# Altium project iMX6_Pixhawk.PrjPcb (part 2 of 6)

## Sheet [05] - HDMI INPUT.SchDoc
size A3; DocumentNumber: 5; SheetNumber: 5; SheetTotal: 18
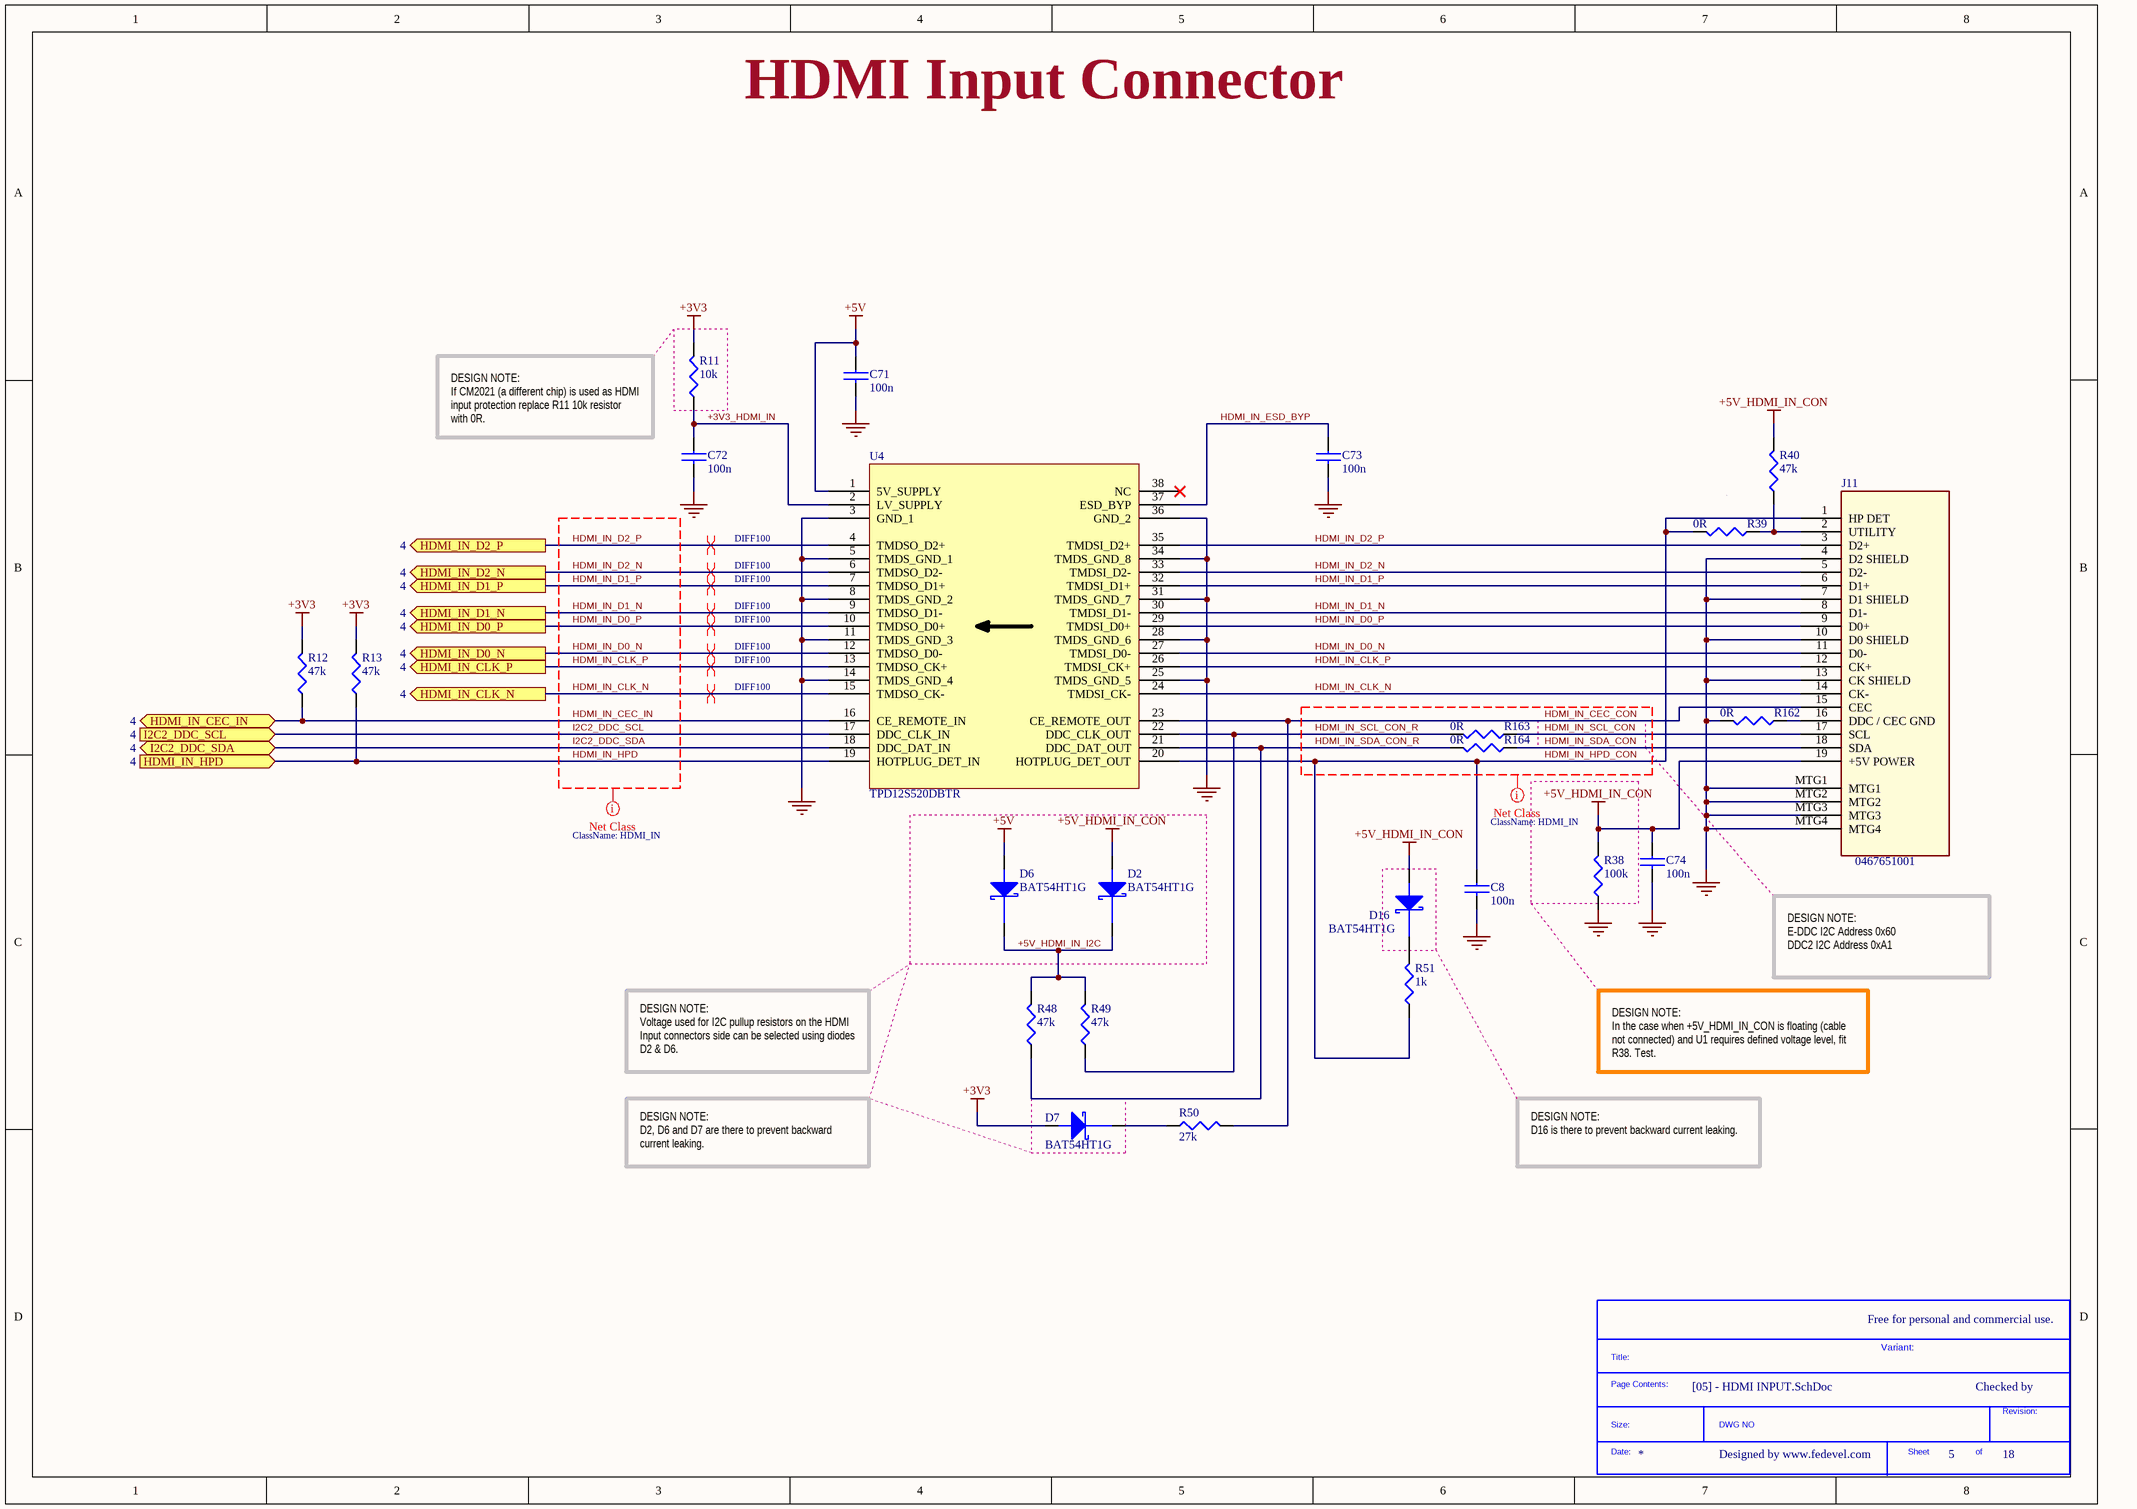
[diagram p7: [05] - HDMI INPUT.SchDoc]

### Parts
(Parts that share a designator on the sheet are numbered #1, #2 ... from top to bottom, then left to right.)
*#5  SDTitleBlock  (value not drawn)  (graphical)
C8  100n  [C0402]
C71  100n  [C0402]
C72  100n  [C0402]
C73  100n  [C0402]
C74  100n  [C0402]
D2  BAT54HT1G  [SOD323]
D6  BAT54HT1G  [SOD323]
D7  BAT54HT1G  [SOD323]
D16  BAT54HT1G  [SOD323]
J11  0467651001  [Micro_HDMI]
R11  10k  [R0402]
R12  47k  [R0402]
R13  47k  [R0402]
R38  100k  [R0402]
R39  0R  [R0402]
R40  47k  [R0402]
R48  47k  [R0402]
R49  47k  [R0402]
R50  27k  [R0402]
R51  1k  [R0402]
R162  0R  [R0402]
R163  0R  [R0402]
R164  0R  [R0402]
U4  TPD12S520DBTR  [TSSOP_38]

### Ports
HDMI_IN_CEC_IN (bidir, see 4), HDMI_IN_CLK_N (out, see 4), HDMI_IN_CLK_P (out, see 4), HDMI_IN_D0_N (out, see 4), HDMI_IN_D0_P (out, see 4), HDMI_IN_D1_N (out, see 4), HDMI_IN_D1_P (out, see 4), HDMI_IN_D2_N (out, see 4), HDMI_IN_D2_P (out, see 4), HDMI_IN_HPD (in, see 4), I2C2_DDC_SCL (in, see 4), I2C2_DDC_SDA (bidir, see 4)

### Nets
+3V3: D7.2(Anode) R11.2 R12.2 R13.2
+5V: C71.1 D6.2(Anode) U4.1(5V_SUPPLY)
+5V_HDMI_IN_CON: C74.1 D2.2(Anode) D16.2(Anode) J11.19(+5V_POWER) R38.2 R40.2
GND: C8.2 C71.2 C72.2 C73.2 C74.2 J11.4(D2_SHIELD) J11.7(D1_SHIELD) J11.10(D0_SHIELD) J11.13(CK_SHIELD) J11.MTG1 J11.MTG2 J11.MTG3 J11.MTG4 R38.1 R162.2 U4.3(GND_1) U4.5(TMDS_GND_1) U4.8(TMDS_GND_2) U4.11(TMDS_GND_3) U4.14(TMDS_GND_4) U4.25(TMDS_GND_5) U4.28(TMDS_GND_6) U4.31(TMDS_GND_7) U4.34(TMDS_GND_8) U4.36(GND_2)
+3V3_HDMI_IN: C72.1 R11.1 U4.2(LV_SUPPLY)
+5V_HDMI_IN_I2C: D2.1(Cathode) D6.1(Cathode) R48.2 R49.2
HDMI_IN_CEC_CON: J11.15(CEC) R50.2 U4.23(CE_REMOTE_OUT)
HDMI_IN_CEC_IN: R12.1 U4.16(CE_REMOTE_IN) ; port HDMI_IN_CEC_IN
HDMI_IN_CLK_N: J11.14(CK-) U4.15(TMDSO_CK-) U4.24(TMDSI_CK-) ; port HDMI_IN_CLK_N
HDMI_IN_CLK_P: J11.12(CK+) U4.13(TMDSO_CK+) U4.26(TMDSI_CK+) ; port HDMI_IN_CLK_P
HDMI_IN_D0_N: J11.11(D0-) U4.12(TMDSO_D0-) U4.27(TMDSI_D0-) ; port HDMI_IN_D0_N
HDMI_IN_D0_P: J11.9(D0+) U4.10(TMDSO_D0+) U4.29(TMDSI_D0+) ; port HDMI_IN_D0_P
HDMI_IN_D1_N: J11.8(D1-) U4.9(TMDSO_D1-) U4.30(TMDSI_D1-) ; port HDMI_IN_D1_N
HDMI_IN_D1_P: J11.6(D1+) U4.7(TMDSO_D1+) U4.32(TMDSI_D1+) ; port HDMI_IN_D1_P
HDMI_IN_D2_N: J11.5(D2-) U4.6(TMDSO_D2-) U4.33(TMDSI_D2-) ; port HDMI_IN_D2_N
HDMI_IN_D2_P: J11.3(D2+) U4.4(TMDSO_D2+) U4.35(TMDSI_D2+) ; port HDMI_IN_D2_P
HDMI_IN_ESD_BYP: C73.1 U4.37(ESD_BYP)
HDMI_IN_HPD: R13.1 U4.19(HOTPLUG_DET_IN) ; port HDMI_IN_HPD
HDMI_IN_HPD_CON: C8.1 J11.1(HP_DET) R39.2 R51.1 U4.20(HOTPLUG_DET_OUT)
HDMI_IN_SCL_CON: J11.17(SCL) R163.1
HDMI_IN_SCL_CON_R: R49.1 R163.2 U4.22(DDC_CLK_OUT)
HDMI_IN_SDA_CON: J11.18(SDA) R164.1
HDMI_IN_SDA_CON_R: R48.1 R164.2 U4.21(DDC_DAT_OUT)
I2C2_DDC_SCL: U4.17(DDC_CLK_IN) ; port I2C2_DDC_SCL
I2C2_DDC_SDA: U4.18(DDC_DAT_IN) ; port I2C2_DDC_SDA
NetD7_1: D7.1(Cathode) R50.1
NetD16_1: D16.1(Cathode) R51.2
NetJ11_2: J11.2(UTILITY) R39.1 R40.1
NetJ11_16: J11.16(DDC_/_CEC_GND) R162.1

Not connected (* = marked no-connect by the designer): U4 38(NC)*

### Layout directives
net class HDMI_IN: HDMI_IN_CEC_CON, HDMI_IN_CEC_IN, HDMI_IN_CLK_N, HDMI_IN_CLK_P, HDMI_IN_D0_N, HDMI_IN_D0_P, HDMI_IN_D1_N, HDMI_IN_D1_P, HDMI_IN_D2_N, HDMI_IN_D2_P, HDMI_IN_HPD, HDMI_IN_HPD_CON, HDMI_IN_SCL_CON, HDMI_IN_SCL_CON_R, HDMI_IN_SDA_CON, HDMI_IN_SDA_CON_R, I2C2_DDC_SCL, I2C2_DDC_SDA
differential pair; net class DIFF100: HDMI_IN_CLK_N, HDMI_IN_CLK_P, HDMI_IN_D0_N, HDMI_IN_D0_P, HDMI_IN_D1_N, HDMI_IN_D1_P, HDMI_IN_D2_N, HDMI_IN_D2_P

### Notes on the sheet
- HDMI Input Connector
- DESIGN NOTE:
  If CM2021 (a different chip) is used as HDMI input protection replace R11 10k resistor with 0R.
- DESIGN NOTE:
  E-DDC I2C Address 0x60
  DDC2 I2C Address 0xA1
- DESIGN NOTE:
  In the case when +5V_HDMI_IN_CON is floating (cable not connected) and U1 requires defined voltage level, fit R38. Test.
- DESIGN NOTE:
  Voltage used for I2C pullup resistors on the HDMI Input connectors side can be selected using diodes D2 & D6.
- DESIGN NOTE:
  D2, D6 and D7 are there to prevent backward current leaking.
- DESIGN NOTE:
  D16 is there to prevent backward current leaking.
- Free for personal and commercial use.
- Variant:
- Checked by
- Designed by www.fedevel.com
- (in symbol SDTitleBlock) Title:; Page Contents:; Revision:; Size:; DWG NO; Date:; Sheet; of

### Library data of the parts
C8 C71-C74 = C1005X5R1H104K: as C4 on sheet [03] - CONNECTORS; Category: Capacitors; Supplier Part Number: 445-5942-1-ND; Manufacturer Part Number: C1005X5R1H104K; Operating Temperature: -55°C ~ 85°C; Package / Case: 0402 (1005 Metric); Price 1k [$]: 0.02340; .Checked SCH: used; Voltage - Rated: 50V; Supplier: Digikey; Supplier 1: Digi-Key; Supplier Part Number 1: 445-5942-1-ND; RoHS: RoHS Compliant; Stock 1: 106926; Pricing 1: 1=0.27, 10=0.18, 100=0.072, 250=0.05176, 500=0.0369, 1000=0.027 (USD); Tolerance: ±10%; Temperature Coefficient: X5R; Mounting Type: Surface Mount, MLCC; Applications: General Purpose; Ratings: -; Size / Dimension: 0.039" L x 0.020" W (1.00mm x 0.50mm); Height - Seated (Max): -; Thickness (Max): 0.022" (0.55mm); Lead Spacing: -; Features: -; Packaging: Cut Tape (CT); Lead Style: -; ComponentLink1URL: http://www.tdk.co.jp/tefe02/e412_c.pdf; ComponentLink1Description: http://www.tdk.co.jp/tefe02/e412_c.pdf
D2 D6 D7 D16 = BAT54HT1G: DIODE SCHOTTKY 30V 0.2A SOD323; Manufacturer: Fairchild Semiconductor; Current - Average Rectified (Io): 200mA; Voltage - Forward (Vf) (Max) @ If: 800mV @ 100mA; Speed: Small Signal =< 200mA (Io), Any Speed; Reverse Recovery Time (trr): 5ns; Current - Reverse Leakage @ Vr: 2µA @ 25V; Capacitance @ Vr, F: 10pF @ 1V, 1MHz; Thermal Resistance: 600°C/W Ja; .Creator: MM; .Checked PCB: used; Supplier 1: Digi-Key; Manufacturer Part Number: BAT54HT1G; RoHS: RoHS Compliant; Category: Discrete Semiconductor Products; Stock 1: 11388; Pricing 1: 1=0.3, 10=0.276, 25=0.1984, 100=0.1543, 250=0.09696, 500=0.0826, 1000=0.05628 (USD); Packaging: Cut Tape (CT); Diode Type: Schottky; Voltage - DC Reverse (Vr) (Max): 30V; Mounting Type: Surface Mount; Package / Case: SC-76, SOD-323; Supplier Device Package: SOD-323; Operating Temperature - Junction: -55°C ~ 150°C; ComponentLink1URL: http://www.fairchildsemi.com/ds/BA/BAT54HT1G.pdf; ComponentLink1Description: http://www.fairchildsemi.com/ds/BA/BAT54HT1G.pdf; Supplier Part Number 1: BAT54HT1GCT-ND; .Checked SCH: used
J11 = 0467651001: CONN RCPT HDMI MICRO TYPE-D R/A; Manufacturer: Molex Inc; Connector Type: HDMI - Micro; Number of Contacts: 19; Gender: Receptacle; .Creator: MM; .Checked PCB: MM, paper model not checked; Supplier 1: Digi-Key; Manufacturer Part Number: 0467651001; RoHS: RoHS Compliant; Category: Connectors, Interconnects; Stock 1: 11830; Pricing 1: 1=2.66, 10=2.414, 25=2.2664, 50=2.1678, 100=2.0693, 250=1.87224, 500=1.72442 (USD); Packaging: Cut Tape (CT); Specifications: -; Mounting Type: Surface Mount, Right Angle, Horizontal; Features: Board Guide; Ingress Protection: -; ComponentLink1URL: http://www.molex.com/pdm_docs/sd/467651001_sd.pdf; ComponentLink1Description: http://www.molex.com/pdm_docs/sd/467651001_sd.pdf; Supplier Part Number 1: WM1282CT-ND; .Checked SCH: MM
R11 = RC0402FR-0710KL: as R1 on sheet [04] - VIDEO INPUT; Category: Resistors; Supplier Part Number: 311-10.0KLRCT-ND; Manufacturer Part Number: RC0402FR-0710KL; Package / Case: 0402 (1005 Metric); Price 1k [$]: 0.01421; Resistance (Ohms): 10K; Tolerance: ±1%; Value: 10k; .Checked SCH: used; Supplier: Digikey; Supplier 1: Digi-Key; Supplier Part Number 1: 311-10.0KLRCT-ND; RoHS: RoHS Compliant; Stock 1: 2916495; Pricing 1: 10=0.014, 50=0.0104, 100=0.0079, 250=0.00584, 500=0.00432, 1000=0.00288 (USD); Composition: Thick Film; Features: -; Size / Dimension: 0.039" L x 0.020" W (1.00mm x 0.50mm); Height: 0.016" (0.40mm); Number of Terminations: 2; Packaging: Cut Tape (CT); ComponentLink1URL: http://www.yageo.com/documents/recent/PYu-RC0402_51_RoHS_L_6.pdf; ComponentLink1Description: http://www.yageo.com/documents/recent/PYu-RC0402_51_RoHS_L_6.pdf
R12 R13 R40 R48 R49 = RC0402FR-0747KL: RES 47.0K OHM 1/16W 1% 0402 SMD; Manufacturer: Yageo; Power (Watts): 0.063W, 1/16W; .Checked PCB: used; Temperature Coefficient: ±100ppm/°C; Category: Resistors; Supplier Part Number: 311-47.0KLRCT-ND; Manufacturer Part Number: RC0402FR-0747KL; Package / Case: 0402 (1005 Metric); Price 1k [$]: 0.01421; Resistance (Ohms): 47K; Tolerance: ±1%; Value: 47k; .Checked SCH: used; Supplier: Digikey; Supplier 1: Digi-Key; Supplier Part Number 1: 311-47.0KLRCT-ND; RoHS: RoHS Compliant; Stock 1: 1227580; Pricing 1: 10=0.014, 50=0.0104, 100=0.0079, 250=0.00584, 500=0.00432, 1000=0.00288 (USD); Composition: Thick Film; Features: -; Size / Dimension: 0.039" L x 0.020" W (1.00mm x 0.50mm); Height: 0.016" (0.40mm); Number of Terminations: 2; Packaging: Cut Tape (CT); ComponentLink1URL: http://www.yageo.com/documents/recent/PYu-RC0402_51_RoHS_L_6.pdf; ComponentLink1Description: http://www.yageo.com/documents/recent/PYu-RC0402_51_RoHS_L_6.pdf
R38 = RMCF0402FT100K: RES 100K OHM 1/16W 1% 0402 SMD; Manufacturer: Stackpole Electronics Inc; Power (Watts): 0.063W, 1/16W; .Checked PCB: used; Temperature Coefficient: ±100ppm/°C; Category: Resistors; Supplier Part Number: RMCF0402FT100KCT-ND; Manufacturer Part Number: RMCF0402FT100K; Package / Case: 0402 (1005 Metric); Price 1k [$]: 0.00384; Resistance (Ohms): 100K; Tolerance: ±1%; Value: 100k; .Checked SCH: used; Supplier: Digikey; Supplier 1: Digi-Key; Supplier Part Number 1: RMCF0402FT100KCT-ND; RoHS: RoHS Compliant; Stock 1: 95; Pricing 1: 1=0.04, 10=0.025, 50=0.0138, 100=0.0105, 250=0.0078, 500=0.00576, 1000=0.00384 (USD); Composition: Thick Film; Features: -; Size / Dimension: 0.039" L x 0.020" W (1.00mm x 0.50mm); Height: 0.016" (0.40mm); Number of Terminations: 2; Packaging: Cut Tape (CT); ComponentLink1URL: http://www.seielect.com/Catalog/SEI-RMCF.pdf; ComponentLink1Description: http://www.seielect.com/Catalog/SEI-RMCF.pdf
R39 R162-R164 = RC0402JR-070RL: as R5 on sheet [04] - VIDEO INPUT; Category: Resistors; Manufacturer Part Number: RC0402JR-070RL; Package / Case: 0402 (1005 Metric); Price 1k [$]: 0.01389; Value: 0R; .Checked SCH: used; Supplier Part Number: 311-0.0JRCT-ND; Supplier: Digikey; Supplier 1: Digi-Key; Supplier Part Number 1: 311-0.0JRCT-ND; RoHS: RoHS Compliant; Stock 1: 1106330; Pricing 1: 10=0.012, 50=0.009, 100=0.0069, 250=0.00512, 500=0.0038, 1000=0.00253 (USD); Composition: Thick Film; Features: -; Temperature Coefficient: -; Size / Dimension: 0.039" L x 0.020" W (1.00mm x 0.50mm); Height: 0.016" (0.40mm); Number of Terminations: 2; Packaging: Cut Tape (CT); ComponentLink1URL: http://www.yageo.com/documents/recent/PYu-RC0402_51_RoHS_L_6.pdf; ComponentLink1Description: http://www.yageo.com/documents/recent/PYu-RC0402_51_RoHS_L_6.pdf
R50 = RC0402FR-0727KL: RES 27.0K OHM 1/16W 1% 0402 SMD; Manufacturer: Yageo; Power (Watts): 0.063W, 1/16W; .Checked PCB: used; Temperature Coefficient: ±100ppm/°C; Category: Resistors; Supplier Part Number: 311-27.0KLRCT-ND; Manufacturer Part Number: RC0402FR-0727KL; Package / Case: 0402 (1005 Metric); Price 1k [$]: 0.00288; Resistance (Ohms): 27K; Tolerance: ±1%; Value: 27k; .Checked SCH: used; Supplier: Digikey; Supplier 1: Digi-Key; Supplier Part Number 1: 311-27.0KLRCT-ND; RoHS: RoHS Compliant; Stock 1: 21638; Pricing 1: 10=0.014, 50=0.0104, 100=0.0079, 250=0.00584, 500=0.00432, 1000=0.00288 (USD); Composition: Thick Film; Features: -; Size / Dimension: 0.039" L x 0.020" W (1.00mm x 0.50mm); Height: 0.016" (0.40mm); Number of Terminations: 2; Packaging: Cut Tape (CT); ComponentLink1URL: http://www.yageo.com/documents/recent/PYu-RC0402_51_RoHS_L_6.pdf; ComponentLink1Description: http://www.yageo.com/documents/recent/PYu-RC0402_51_RoHS_L_6.pdf
R51 = RC0402FR-071KL: RES 1.00K OHM 1/16W 1% 0402 SMD; Manufacturer: Yageo; Power (Watts): 0.063W, 1/16W; .Checked PCB: used; Temperature Coefficient: ±100ppm/°C; Category: Resistors; Supplier Part Number: 311-1.00KLRCT-ND; Manufacturer Part Number: RC0402FR-071KL; Package / Case: 0402 (1005 Metric); Price 1k [$]: 0.01421; Resistance (Ohms): 1K; Tolerance: ±1%; Value: 1k; .Checked SCH: used; Supplier: Digikey; Supplier 1: Digi-Key; Supplier Part Number 1: 311-1.00KLRCT-ND; RoHS: RoHS Compliant; Stock 1: 1753477; Pricing 1: 10=0.014, 50=0.0104, 100=0.0079, 250=0.00584, 500=0.00432, 1000=0.00288 (USD); Composition: Thick Film; Features: -; Size / Dimension: 0.039" L x 0.020" W (1.00mm x 0.50mm); Height: 0.016" (0.40mm); Number of Terminations: 2; Packaging: Cut Tape (CT); ComponentLink1URL: http://www.yageo.com/documents/recent/PYu-RC0402_51_RoHS_L_6.pdf; ComponentLink1Description: http://www.yageo.com/documents/recent/PYu-RC0402_51_RoHS_L_6.pdf
U4 = TPD12S520DBTR: IC HDMI RCVR PORT PROT 38-TSSOP; Manufacturer: Texas Instruments; Voltage - Supply: 5V; .Creator: MM; Supplier 1: Digi-Key; Manufacturer Part Number: TPD12S520DBTR; RoHS: RoHS Compliant; Category: Integrated Circuits (ICs); Stock 1: 5619; Pricing 1: 1=1.87, 10=1.685, 25=1.5092, 100=1.3572, 250=1.20512, 500=1.053, 750=0.95355, 1000=0.73125 (USD); Packaging: Cut Tape (CT); Applications: Video Equipment; Interface: HDMI; Package / Case: 38-TFSOP (0.173", 4.40mm Width); Supplier Device Package: 38-TSSOP; Mounting Type: Surface Mount; ComponentLink1URL: http://www.ti.com/lit/ds/symlink/tpd12s520.pdf; ComponentLink1Description: http://www.ti.com/lit/ds/symlink/tpd12s520.pdf; Supplier Part Number 1: 296-23617-1-ND; .Checked PCB: MM; .Checked SCH: MM

## Sheet [07] - PCIE MINI.SchDoc
size A2; DocumentNumber: 7; SheetNumber: 7; SheetTotal: 18
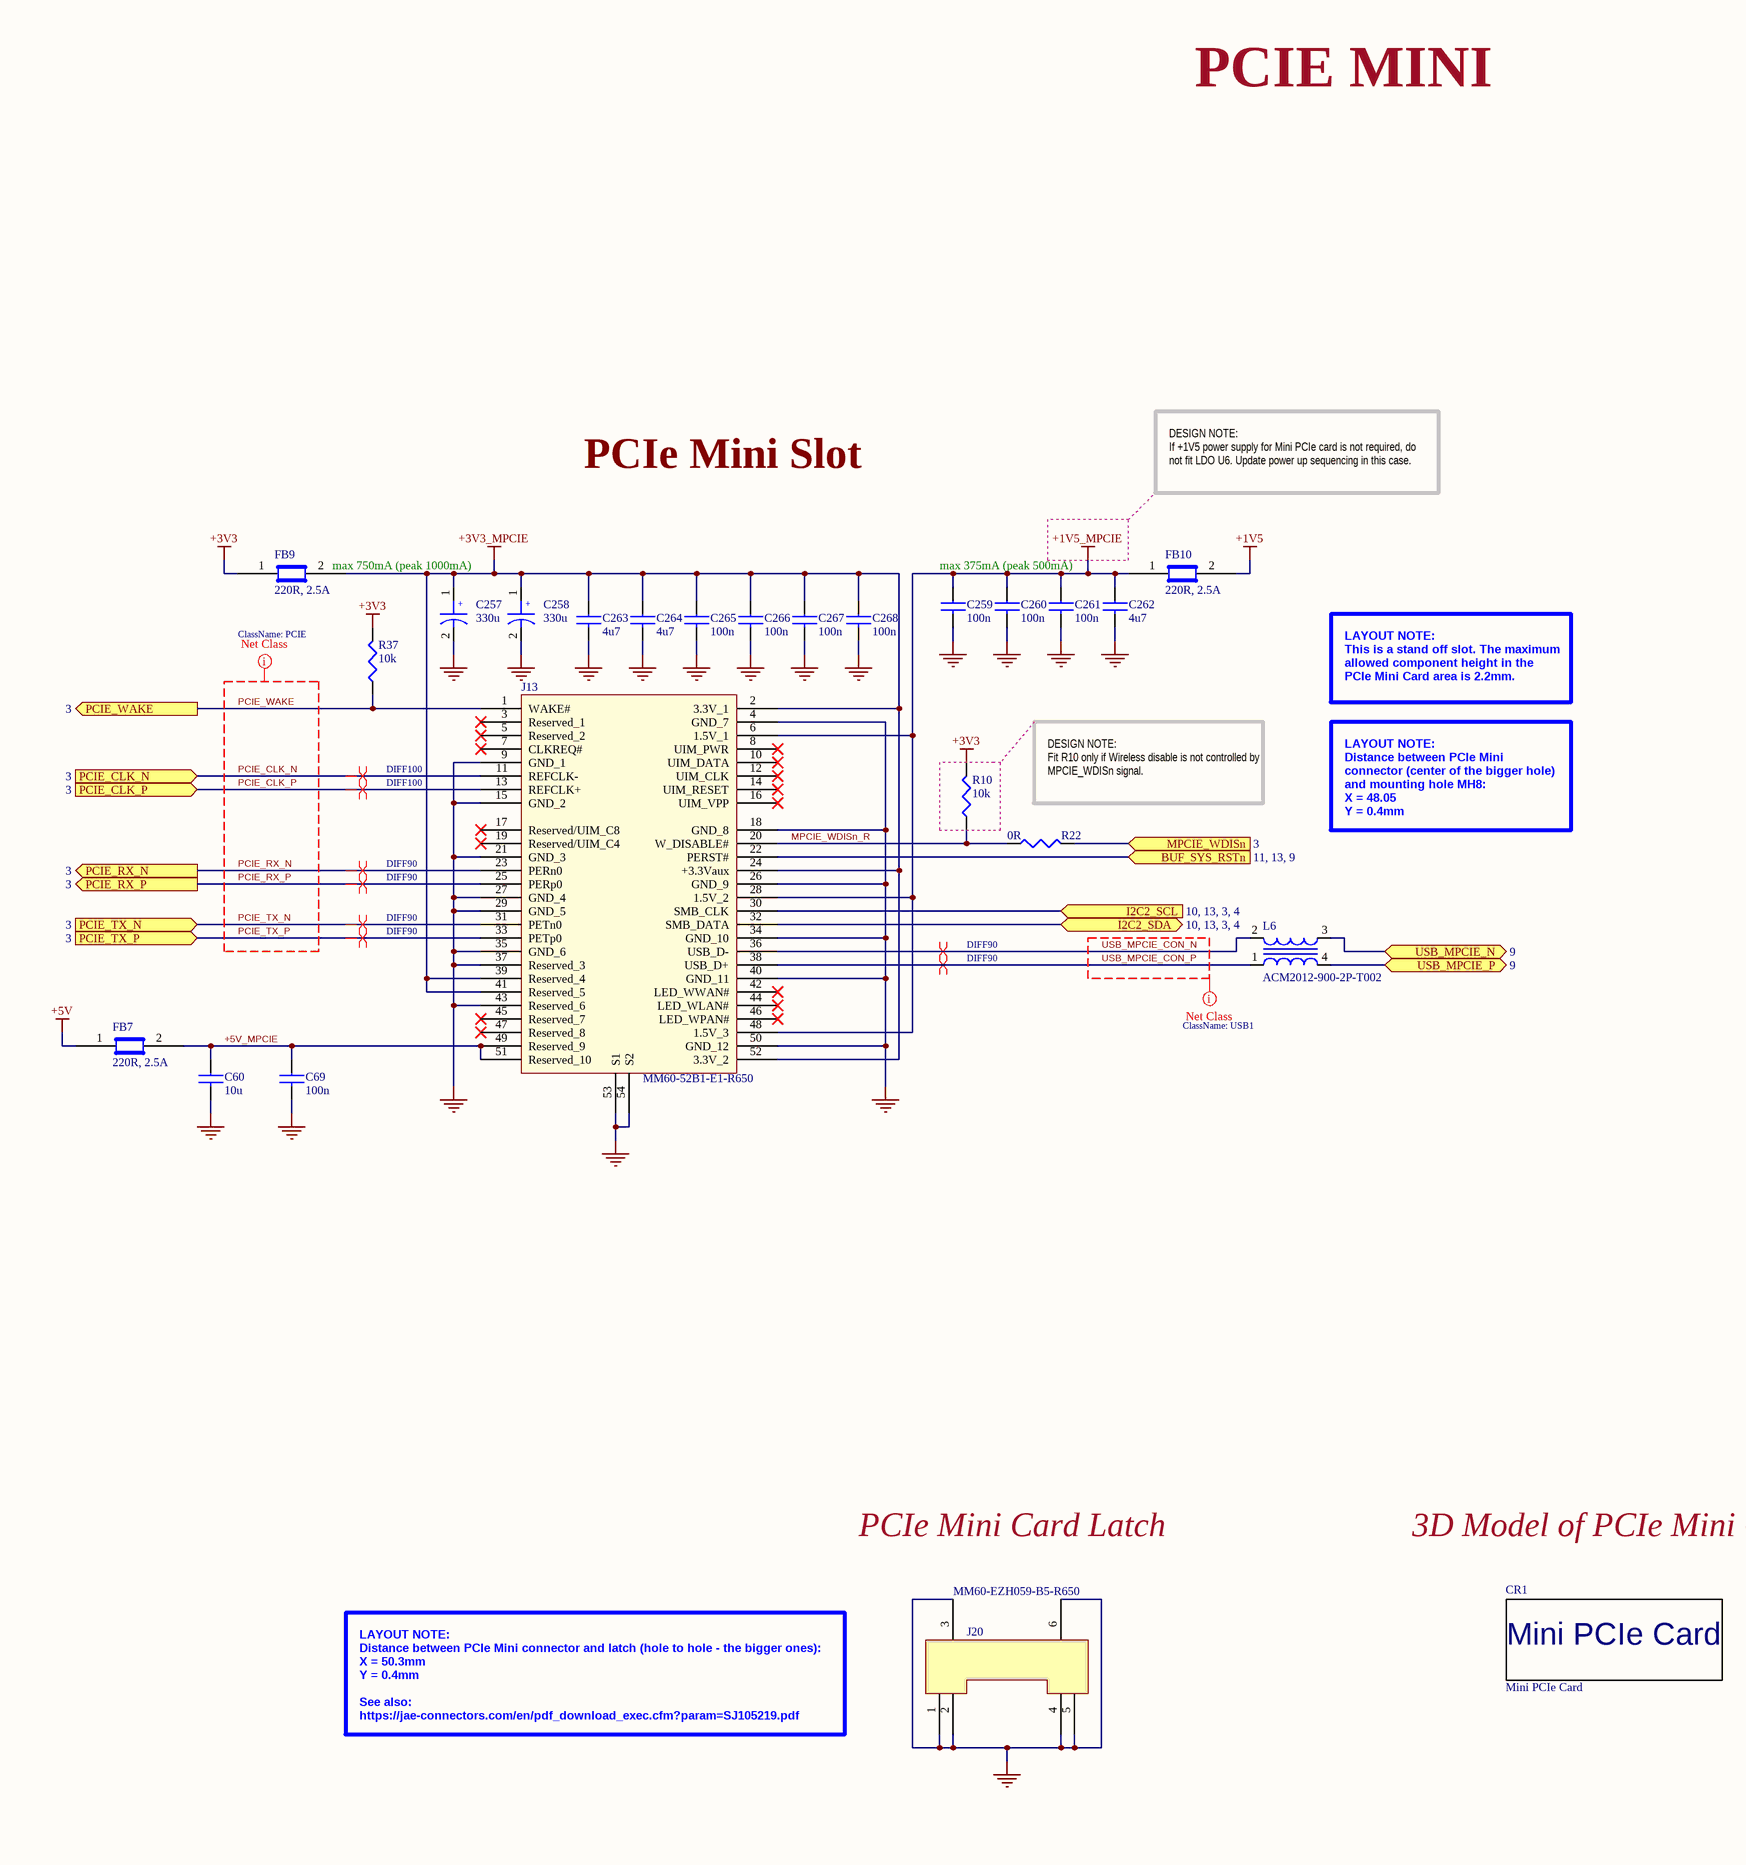
[diagram p8: [07] - PCIE MINI.SchDoc, left]
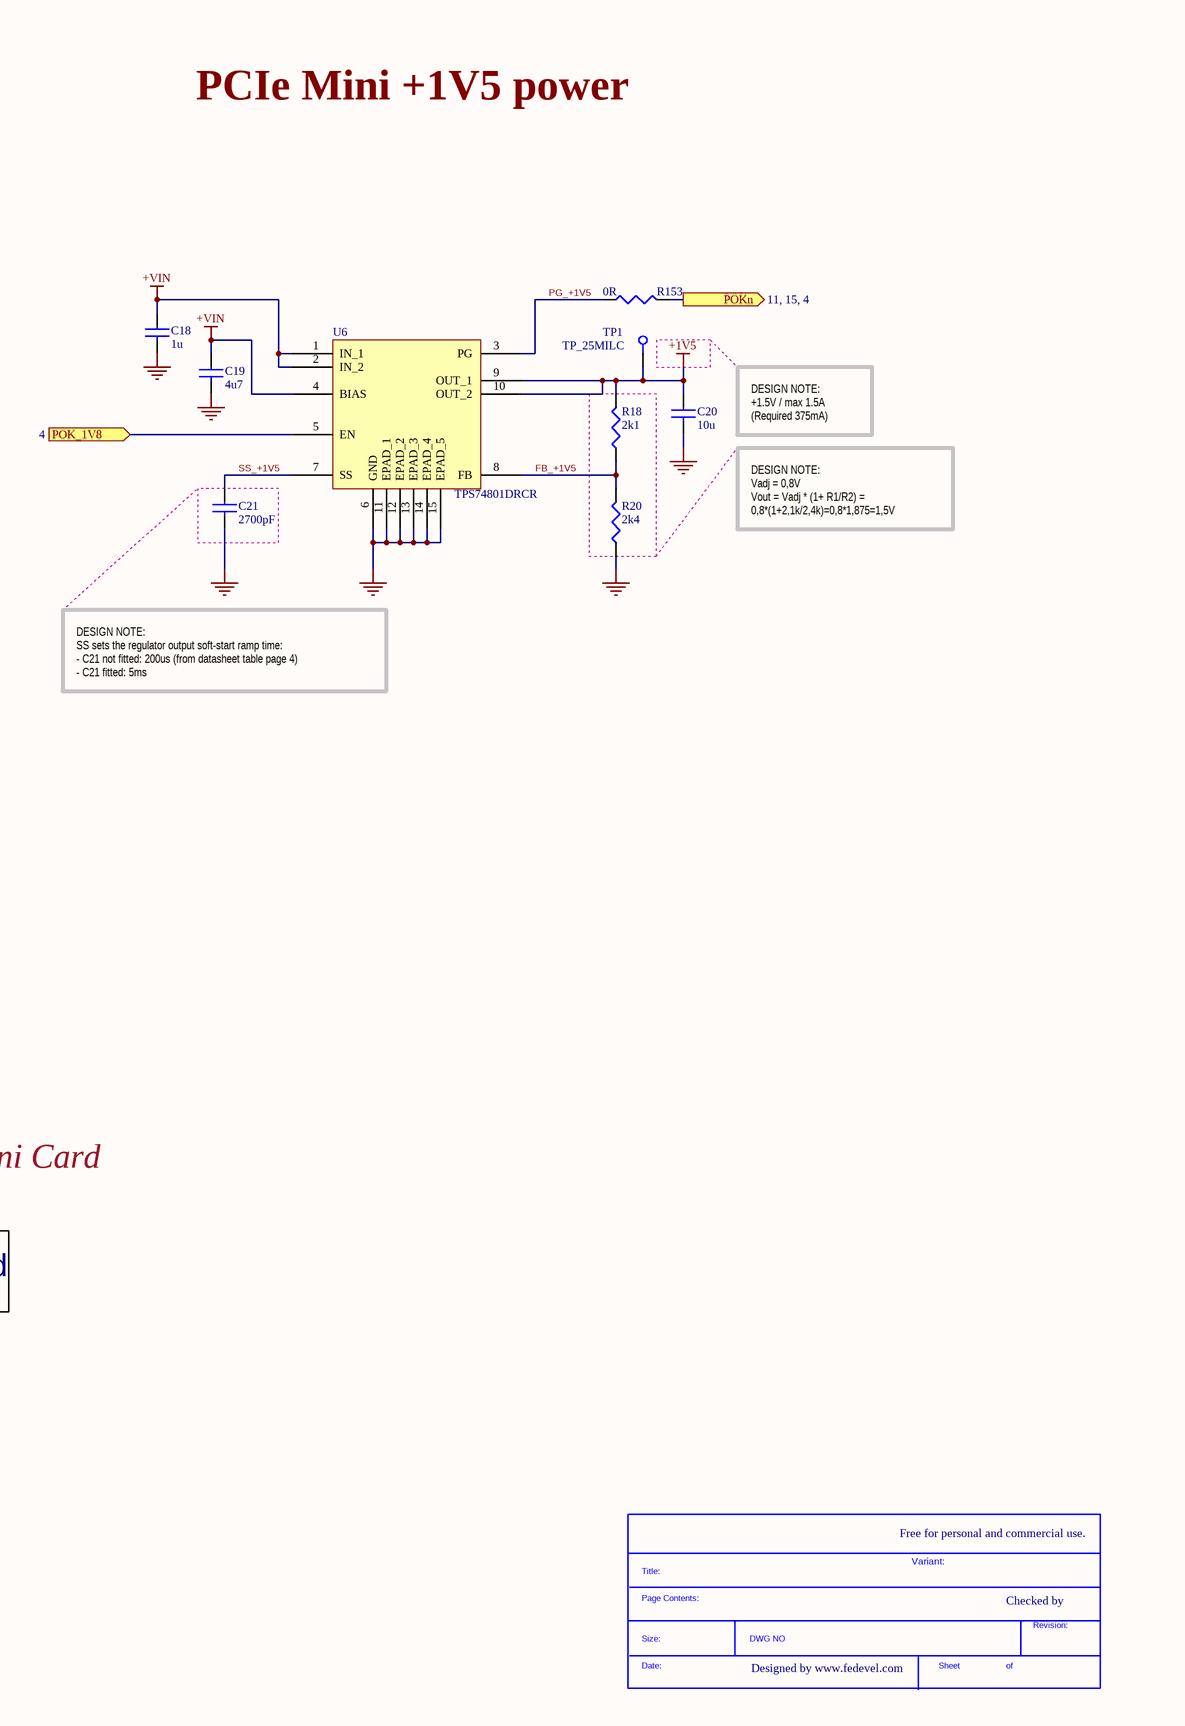
[diagram p9: [07] - PCIE MINI.SchDoc, right]

### Parts
(Parts that share a designator on the sheet are numbered #1, #2 ... from top to bottom, then left to right.)
*#6  SDTitleBlock  (value not drawn)  (graphical)
C18  1u  [C0402]
C19  4u7  [C0402]
C20  10u  [C0603]
C21  2700pF  [C0402]
C60  10u  [C0603]
C69  100n  [C0402]
C257  330u  [C2917]
C258  330u  [C2917]
C259  100n  [C0402]
C260  100n  [C0402]
C261  100n  [C0402]
C262  4u7  [C0402]
C263  4u7  [C0402]
C264  4u7  [C0402]
C265  100n  [C0402]
C266  100n  [C0402]
C267  100n  [C0402]
C268  100n  [C0402]
CR1  Mini PCIe Card  [Mini_PCIe_full card]  (no BOM)
FB7  220R, 2.5A  [C0603]
FB9  220R, 2.5A  [C0603]
FB10  220R, 2.5A  [C0603]
J13  MM60-52B1-E1-R650  [MINI_PCIE_52PIN_CARD_CON]
J20  MM60-EZH059-B5-R650  [MINI_PCIE_52PIN_CARD_LATCH]
L6  ACM2012-900-2P-T002  [ACM2012]
R10  10k  [R0402]
R18  2k1  [R0402]
R20  2k4  [R0402]
R22  0R  [R0402]
R37  10k  [R0402]
R153  0R  [R0402]
TP1  TP_25MILC  [TP_25C]  (no BOM)
U6  TPS74801DRCR  [DRC (S-PVSON-N10)]

### Ports
BUF_SYS_RSTn (see 11, 13, 9), I2C2_SCL (see 10, 13, 3, 4), I2C2_SDA (bidir, see 10, 13, 3, 4), MPCIE_WDISn (in, see 3), PCIE_CLK_N (in, see 3), PCIE_CLK_P (in, see 3), PCIE_RX_N (out, see 3), PCIE_RX_P (out, see 3), PCIE_TX_N (in, see 3), PCIE_TX_P (in, see 3), PCIE_WAKE (out, see 3), POK_1V8 (in, see 4), POKn (see 11, 15, 4), USB_MPCIE_N (bidir, see 9), USB_MPCIE_P (bidir, see 9)

### Nets
+1V5: C20.1 FB10.2 R18.2 TP1.1 U6.9(OUT_1) U6.10(OUT_2)
+1V5_MPCIE: C259.1 C260.1 C261.1 C262.1 FB10.1 J13.6(1.5V_1) J13.28(1.5V_2) J13.48(1.5V_3)
+3V3: FB9.1 R10.2 R37.2
+3V3_MPCIE: C257.1 C258.1 C263.1 C264.1 C265.1 C266.1 C267.1 C268.1 FB9.2 J13.2(3.3V_1) J13.24(+3.3Vaux) J13.39(Reserved_4) J13.41(Reserved_5) J13.52(3.3V_2)
+5V: FB7.1
+VIN: C18.1 C19.1 U6.1(IN_1) U6.2(IN_2) U6.4(BIAS)
GND: C18.2 C19.2 C20.2 C21.2 C60.2 C69.2 C257.2 C258.2 C259.2 C260.2 C261.2 C262.2 C263.2 C264.2 C265.2 C266.2 C267.2 C268.2 J13.4(GND_7) J13.9(GND_1) J13.15(GND_2) J13.18(GND_8) J13.21(GND_3) J13.26(GND_9) J13.27(GND_4) J13.29(GND_5) J13.34(GND_10) J13.35(GND_6) J13.37(Reserved_3) J13.40(GND_11) J13.43(Reserved_6) J13.50(GND_12) J13.53(S1) J13.54(S2) J20.1 J20.2 J20.3 J20.4 J20.5 J20.6 R20.1 U6.6(GND) U6.11(EPAD_1) U6.12(EPAD_2) U6.13(EPAD_3) U6.14(EPAD_4) U6.15(EPAD_5)
+5V_MPCIE: C60.1 C69.1 FB7.2 J13.49(Reserved_9) J13.51(Reserved_10)
FB_+1V5: R18.1 R20.2 U6.8(FB)
I2C2_SCL: J13.30(SMB_CLK) ; port I2C2_SCL
I2C2_SDA: J13.32(SMB_DATA) ; port I2C2_SDA
MPCIE_WDISn_R: J13.20(W_DISABLE#) R10.1 R22.1
PCIE_CLK_N: J13.11(REFCLK-) ; port PCIE_CLK_N
PCIE_CLK_P: J13.13(REFCLK+) ; port PCIE_CLK_P
PCIE_RX_N: J13.23(PERn0) ; port PCIE_RX_N
PCIE_RX_P: J13.25(PERp0) ; port PCIE_RX_P
PCIE_TX_N: J13.31(PETn0) ; port PCIE_TX_N
PCIE_TX_P: J13.33(PETp0) ; port PCIE_TX_P
PCIE_WAKE: J13.1(WAKE#) R37.1 ; port PCIE_WAKE
PG_+1V5: R153.1 U6.3(PG)
SS_+1V5: C21.1 U6.7(SS)
USB1_N: L6.3 ; port USB_MPCIE_N
USB1_P: L6.4 ; port USB_MPCIE_P
USB_MPCIE_CON_N: J13.36(USB_D-) L6.2
USB_MPCIE_CON_P: J13.38(USB_D+) L6.1
NetJ1_40: R22.2 ; port MPCIE_WDISn
NetJ13_22: J13.22(PERST#) ; port BUF_SYS_RSTn
NetQ4_1: R153.2 ; port POKn
NetR5_1: U6.5(EN) ; port POK_1V8

Not connected (* = marked no-connect by the designer): J13 3(Reserved_1)* 5(Reserved_2)* 7(CLKREQ#)* 8(UIM_PWR)* 10(UIM_DATA)* 12(UIM_CLK)* 14(UIM_RESET)* 16(UIM_VPP)* 17(Reserved/UIM_C8)* 19(Reserved/UIM_C4)* 42(LED_WWAN#)* 44(LED_WLAN#)* 45(Reserved_7)* 46(LED_WPAN#)* 47(Reserved_8)*

### Layout directives
differential pair; net class DIFF90: PCIE_RX_N, PCIE_RX_P, PCIE_TX_N, PCIE_TX_P, USB_MPCIE_CON_N, USB_MPCIE_CON_P
net class USB1: USB_MPCIE_CON_N, USB_MPCIE_CON_P
differential pair; net class DIFF100: PCIE_CLK_N, PCIE_CLK_P
net class PCIE: PCIE_CLK_N, PCIE_CLK_P, PCIE_RX_N, PCIE_RX_P, PCIE_TX_N, PCIE_TX_P, PCIE_WAKE

### Notes on the sheet
- PCIE MINI
- PCIe Mini Slot
- DESIGN NOTE:
  If +1V5 power supply for Mini PCIe card is not required, do not fit LDO U6. Update power up sequencing in this case.
- PCIe Mini +1V5 power
- max 750mA (peak 1000mA)
- max 375mA (peak 500mA)
- LAYOUT NOTE:
  This is a stand off slot. The maximum allowed component height in the PCIe Mini Card area is 2.2mm.
- (near R22) DESIGN NOTE:
  Fit R10 only if Wireless disable is not controlled by MPCIE_WDISn signal.
- LAYOUT NOTE:
  Distance between PCIe Mini connector (center of the bigger hole) and mounting hole MH8:
  X = 48.05
  Y = 0.4mm
- DESIGN NOTE:
  +1.5V / max 1.5A
  (Required 375mA)
- DESIGN NOTE:
  Vadj = 0,8V
  Vout = Vadj * (1+ R1/R2) = 0,8*(1+2,1k/2,4k)=0,8*1,875=1,5V
- DESIGN NOTE:
  SS sets the regulator output soft-start ramp time:
  - C21 not fitted: 200us (from datasheet table page 4)
  - C21 fitted: 5ms
- PCIe Mini Card Latch
- 3D Model of PCIe Mini Card
- LAYOUT NOTE:
  Distance between PCIe Mini connector and latch (hole to hole - the bigger ones):
  X = 50.3mm
  Y = 0.4mm
  See also:
  https://jae-connectors.com/en/pdf_download_exec.cfm?param=SJ105219.pdf
- Free for personal and commercial use.
- Variant:
- Checked by
- Designed by www.fedevel.com
- (in symbol SDTitleBlock) Title:; Page Contents:; Revision:; Size:; DWG NO; Date:; Sheet; of
- (in symbol T520D337M006ATE045) +

### Library data of the parts
C18 = C1005X5R1C105K: as C56 on sheet [04] - VIDEO INPUT; Category: Capacitors; Supplier Part Number: 445-4978-1-ND; Manufacturer Part Number: C1005X5R1C105K; Operating Temperature: -55°C ~ 85°C; Package / Case: 0402 (1005 Metric); Price 1k [$]: 0.02080; .Checked SCH: used; Voltage - Rated: 16V; Supplier: Digikey; Supplier 1: Digi-Key; Supplier Part Number 1: 445-4978-1-ND; RoHS: RoHS Compliant; Stock 1: 341010; Pricing 1: 1=0.24, 10=0.16, 100=0.064, 250=0.046, 500=0.0328, 1000=0.024 (USD); Temperature Coefficient: X5R; Mounting Type: Surface Mount, MLCC; Applications: General Purpose; Ratings: -; Size / Dimension: 0.039" L x 0.020" W (1.00mm x 0.50mm); Height - Seated (Max): -; Thickness (Max): 0.022" (0.55mm); Lead Spacing: -; Features: -; Packaging: Cut Tape (CT); Lead Style: -; ComponentLink1URL: http://www.tdk.co.jp/tefe02/e412_c.pdf; ComponentLink1Description: http://www.tdk.co.jp/tefe02/e412_c.pdf
C19 C262-C264 = C1005X5R1A475M: as C57 on sheet [04] - VIDEO INPUT; Supplier 1: Digi-Key; Supplier Part Number 1: 445-8023-1-ND; Manufacturer Part Number: C1005X5R1A475M; RoHS: RoHS Compliant; Category: Capacitors; Stock 1: 10140; Pricing 1: 1=0.53, 10=0.415, 100=0.25, 250=0.18752, 500=0.16, 1000=0.125, 5000=0.095 (USD); Voltage - Rated: 10V; Tolerance: ±20%; Temperature Coefficient: X5R; Mounting Type: Surface Mount, MLCC; Operating Temperature: -55°C ~ 85°C; Applications: General Purpose; Ratings: -; Package / Case: 0402 (1005 Metric); Size / Dimension: 0.039" L x 0.020" W (1.00mm x 0.50mm); Height - Seated (Max): -; Thickness (Max): -; Lead Spacing: -; Features: -; Packaging: Cut Tape (CT); Lead Style: -; ComponentLink1URL: http://www.tdk.com/pdf/general_B11.pdf; ComponentLink1Description: http://www.tdk.com/pdf/general_B11.pdf; .Checked SCH: used
C20 C60 = C1608X5R0J106M: as C58 on sheet [04] - VIDEO INPUT; Category: Capacitors; Supplier Part Number: 445-4112-1-ND; Manufacturer Part Number: C1608X5R0J106M; Operating Temperature: -55°C ~ 85°C; Package / Case: 0603 (1608 Metric); Price 1k [$]: 0.08580; .Checked SCH: used; Voltage - Rated: 6.3V; Features: Low ESR; Supplier: Digikey; Supplier 1: Digi-Key; Supplier Part Number 1: 445-4112-1-ND; RoHS: RoHS Compliant; Stock 1: 48157; Pricing 1: 1=0.46, 10=0.363, 100=0.1898, 250=0.14024, 500=0.1089, 1000=0.0858 (USD); Tolerance: ±20%; Temperature Coefficient: X5R; Mounting Type: Surface Mount, MLCC; Applications: General Purpose; Ratings: -; Size / Dimension: 0.063" L x 0.031" W (1.60mm x 0.80mm); Height - Seated (Max): -; Thickness (Max): 0.037" (0.95mm); Lead Spacing: -; Packaging: Cut Tape (CT); Lead Style: -; ComponentLink1URL: http://www.tdk.com/pdf/general_B11.pdf; ComponentLink1Description: http://www.tdk.com/pdf/general_B11.pdf
C21 = GRM155R71H272KA01D: as C59 on sheet [04] - VIDEO INPUT; Supplier 1: Digi-Key; Supplier Part Number 1: 490-1306-1-ND; Manufacturer Part Number: GRM155R71H272KA01D; RoHS: RoHS Compliant; Category: Capacitors; Stock 1: 38160; Pricing 1: 10=0.01, 50=0.0086, 100=0.0074, 250=0.00664, 500=0.00618, 750=0.00571, 1000=0.00542 (USD); Capacitance: 2700pF; Voltage - Rated: 50V; Tolerance: ±10%; Temperature Coefficient: X7R; Mounting Type: Surface Mount, MLCC; Operating Temperature: -55°C ~ 125°C; Applications: General Purpose; Ratings: -; Package / Case: 0402 (1005 Metric); Size / Dimension: 0.039" L x 0.020" W (1.00mm x 0.50mm); Height - Seated (Max): -; Thickness (Max): 0.022" (0.55mm); Lead Spacing: -; Features: -; Packaging: Cut Tape (CT); Lead Style: -; ComponentLink1URL: http://search.murata.co.jp/Ceramy/image/img/PDF/ENG/GRM155R71H272KA01.pdf; ComponentLink1Description: http://search.murata.co.jp/Ceramy/image/img/PDF/ENG/GRM155R71H272KA01.pdf; .Checked SCH: used
C69 C259-C261 C265-C268 = C1005X5R1H104K: as C4 on sheet [03] - CONNECTORS; Category: Capacitors; Supplier Part Number: 445-5942-1-ND; Manufacturer Part Number: C1005X5R1H104K; Operating Temperature: -55°C ~ 85°C; Package / Case: 0402 (1005 Metric); Price 1k [$]: 0.02340; .Checked SCH: used; Voltage - Rated: 50V; Supplier: Digikey; Supplier 1: Digi-Key; Supplier Part Number 1: 445-5942-1-ND; RoHS: RoHS Compliant; Stock 1: 106926; Pricing 1: 1=0.27, 10=0.18, 100=0.072, 250=0.05176, 500=0.0369, 1000=0.027 (USD); Tolerance: ±10%; Temperature Coefficient: X5R; Mounting Type: Surface Mount, MLCC; Applications: General Purpose; Ratings: -; Size / Dimension: 0.039" L x 0.020" W (1.00mm x 0.50mm); Height - Seated (Max): -; Thickness (Max): 0.022" (0.55mm); Lead Spacing: -; Features: -; Packaging: Cut Tape (CT); Lead Style: -; ComponentLink1URL: http://www.tdk.co.jp/tefe02/e412_c.pdf; ComponentLink1Description: http://www.tdk.co.jp/tefe02/e412_c.pdf
C257 C258 = T520D337M006ATE045: CAP TANT 330UF 6.3V 20% 2917; Manufacturer: Kemet; Manufacturer Size Code: D; Capacitance: 330µF; ESR (Equivalent Series Resistance): 45 mOhm; Type: Molded; .Creator: MM; .Checked PCB: used; Supplier 1: Digi-Key; Manufacturer Part Number: T520D337M006ATE045; RoHS: RoHS Compliant; Category: Capacitors; Stock 1: 11758; Pricing 1: 1=1.33, 10=1.05, 50=0.91, 100=0.7875, 250=0.7 (USD); Packaging: Cut Tape (CT); Voltage - Rated: 6.3V; Tolerance: ±20%; Operating Temperature: -55°C ~ 105°C; Mounting Type: Surface Mount; Package / Case: 2917 (7343 Metric); Size / Dimension: 0.287" L x 0.169" W (7.30mm x 4.30mm); Height - Seated (Max): 0.122" (3.10mm); Lead Spacing: -; Features: Polymer; Lifetime @ Temp.: -; ComponentLink1URL: http://www.kemet.com/kemet/web/homepage/kechome.nsf/file/T520%20Series/$file/KEM_T2015_T520.pdf; ComponentLink1Description: http://www.kemet.com/kemet/web/homepage/kechome.nsf/file/T520%20Series/$file/KEM_T2015_T520.pdf; Supplier Part Number 1: 399-4055-1-ND; .Checked SCH: used
CR1 = Card_Mini_PCIe: Card MIni PCIe; .Creator: MM; Category: Card
FB7 FB9 FB10 = BLM18SG221TN1D: FERRITE CHIP 220 OHM 2500MA 0603; Manufacturer: Murata Electronics North America; Impedance @ Frequency: 220 Ohm @ 100MHz; DC Resistance (DCR): 40 mOhm Max; Filter Type: Differential Mode - Single; Number of Lines: 1; .Checked PCB: used; Supplier 1: Digi-Key; Supplier Part Number 1: 490-5225-1-ND; Manufacturer Part Number: BLM18SG221TN1D; RoHS: RoHS Compliant; Category: Filters; Stock 1: 54640; Pricing 1: 1=0.38, 10=0.282, 50=0.1646, 100=0.1316, 250=0.094, 500=0.06392, 1000=0.0517, 5000=0.04042 (USD); Current Rating: 2.5A; Package / Case: 0603 (1608 Metric); Mounting Type: Surface Mount; Packaging: Cut Tape (CT); Height (Max): 0.037" (0.95mm); Size / Dimension: 0.063" L x 0.031" W (1.60mm x 0.80mm); ComponentLink1URL: http://search.murata.co.jp/Ceramy/image/img/PDF/ENG/L0110S0100BLM18S.pdf; ComponentLink1Description: http://search.murata.co.jp/Ceramy/image/img/PDF/ENG/L0110S0100BLM18S.pdf; .Checked SCH: used
J13 = MM60-52B1-E1-R650: CONN MINI EXPRESS CARD 52POS SMD; Manufacturer: JAE Electronics; Card Type: PCI Express Mini Card; Gender: Female; Number of Positions: 52; Card Thickness: 0.039" (1.00mm); Pitch: 0.031" (0.80mm); Material - Insulation: Thermoplastic; Read Out: Dual; .Creator: MM; .Checked PCB: used; Supplier 1: Digi-Key; Manufacturer Part Number: MM60-52B1-E1-R650; RoHS: RoHS Compliant; Category: Connectors, Interconnects; Stock 1: 470; Pricing 1: 1=2.16, 10=1.962, 25=1.842, 100=1.6817, 250=1.52152 (USD); Packaging: Cut Tape (CT); Number of Positions/Bay/Row: -; Number of Rows: 2; Features: Board Guide; Mounting Type: Surface Mount, Right Angle; Termination: Solder; Contact Material: Copper Alloy; Contact Finish: Gold; Contact Finish Thickness: 4µin (0.10µm); Contact Type: -; Color: -; Flange Feature: -; Operating Temperature: -40°C ~ 85°C; ComponentLink1URL: http://jae-connectors.com/en/pdf/JACS-10313_MM60.pdf; ComponentLink1Description: http://jae-connectors.com/en/pdf/JACS-10313_MM60.pdf; Supplier Part Number 1: 670-2275-1-ND; .Checked SCH: used
J20 = MM60-EZH059-B5-R650: CONN MINI EXPRESS CARD LATCH SMD; Manufacturer: JAE Electronics; For Use With/Related Products: PCI Express Mini Card; .Creator: MM; .Checked PCB: used; Supplier 1: Digi-Key; Manufacturer Part Number: MM60-EZH059-B5-R650; RoHS: RoHS Compliant; Category: Connectors, Interconnects; Stock 1: 4853; Pricing 1: 1=1.22, 10=1.075, 25=1.0116, 100=0.9272, 250=0.84292 (USD); Packaging: Cut Tape (CT); Accessory Type: Latch; ComponentLink1URL: http://jae-connector.com/en/pdf/SJ105221.pdf; ComponentLink1Description: http://jae-connector.com/en/pdf/SJ105221.pdf; Supplier Part Number 1: 670-2277-1-ND; .Checked SCH: used
L6 = ACM2012-900-2P-T002: CHOKE COMM MODE 90 OHM .4A SMD; Manufacturer: TDK Corporation; Filter Type: Data, Signal Line; Number of Lines: 2; Current: 400mA; DC Resistance (DCR): 190 mOhm Max; Impedance: 90 Ohm; Resistance (Ohms): 8.2K; Power (Watts): 0.063W, 1/16W; Temperature Coefficient: ±100ppm/°C; Tolerance: ±1%; .Checked PCB: used; Supplier 1: Digi-Key; Supplier Part Number 1: 445-2207-1-ND; Manufacturer Part Number: ACM2012-900-2P-T002; RoHS: RoHS Compliant; Category: Filters; Stock 1: 175768; Pricing 1: 1=0.48, 10=0.448, 50=0.42, 100=0.364, 500=0.308, 1000=0.252 (USD); Inductance: -; Mounting Type: Surface Mount; Size / Dimension: 0.079" L x 0.047" W (2.00mm x 1.20mm); Height (Max): 0.051" (1.30mm); Package / Case: 0805 (2012 Metric), 4 Lead; Operating Temperature: -25°C ~ 85°C; Packaging: Cut Tape (CT); ComponentLink1URL: http://www.tdk.co.jp/tefe02/e9719_acm2012.pdf; ComponentLink1Description: http://www.tdk.co.jp/tefe02/e9719_acm2012.pdf; Composition: Thick Film; Features: -; Height: 0.016" (0.40mm); Number of Terminations: 2; ComponentLink2URL: http://www.yageo.com/documents/recent/PYu-RC0402_51_RoHS_L_6.pdf; ComponentLink2Description: http://www.yageo.com/documents/recent/PYu-RC0402_51_RoHS_L_6.pdf; .Checked SCH: used
R10 R37 = RC0402FR-0710KL: as R1 on sheet [04] - VIDEO INPUT; Category: Resistors; Supplier Part Number: 311-10.0KLRCT-ND; Manufacturer Part Number: RC0402FR-0710KL; Package / Case: 0402 (1005 Metric); Price 1k [$]: 0.01421; Resistance (Ohms): 10K; Tolerance: ±1%; Value: 10k; .Checked SCH: used; Supplier: Digikey; Supplier 1: Digi-Key; Supplier Part Number 1: 311-10.0KLRCT-ND; RoHS: RoHS Compliant; Stock 1: 2916495; Pricing 1: 10=0.014, 50=0.0104, 100=0.0079, 250=0.00584, 500=0.00432, 1000=0.00288 (USD); Composition: Thick Film; Features: -; Size / Dimension: 0.039" L x 0.020" W (1.00mm x 0.50mm); Height: 0.016" (0.40mm); Number of Terminations: 2; Packaging: Cut Tape (CT); ComponentLink1URL: http://www.yageo.com/documents/recent/PYu-RC0402_51_RoHS_L_6.pdf; ComponentLink1Description: http://www.yageo.com/documents/recent/PYu-RC0402_51_RoHS_L_6.pdf
R18 = CRCW04022K10FKED: RES 2.10K OHM 1/16W 1% 0402 SMD; Manufacturer: Vishay Dale; Resistance (Ohms): 2.1k; Power (Watts): 0.063W, 1/16W; Temperature Coefficient: ±100ppm/°C; .Creator: MM; .Checked PCB: used; Supplier 1: Digi-Key; Manufacturer Part Number: CRCW04022K10FKED; RoHS: RoHS Compliant; Category: Resistors; Stock 1: 65680; Pricing 1: 10=0.083, 50=0.0444, 200=0.0255, 1000=0.0174 (USD); Packaging: Cut Tape (CT); Tolerance: ±1%; Composition: Thick Film; Features: Automotive AEC-Q200 Qualified; Package / Case: 0402 (1005 Metric); Supplier Device Package: 0402 (1005 Metric); Size / Dimension: 0.039" L x 0.020" W (1.00mm x 0.50mm); Height: 0.016" (0.40mm); Number of Terminations: 2; ComponentLink1URL: http://www.vishay.com/doc?20035; ComponentLink1Description: http://www.vishay.com/doc?20035; Supplier Part Number 1: 541-2.10KLCT-ND; .Checked SCH: used
R20 = CRCW04022K40FKED: as R83 on sheet [04] - VIDEO INPUT; Supplier 1: Digi-Key; Supplier Part Number 1: 541-2.40KLCT-ND; Manufacturer Part Number: CRCW04022K40FKED; RoHS: RoHS Compliant; Category: Resistors; Stock 1: 43967; Pricing 1: 10=0.083, 50=0.0444, 200=0.0255, 1000=0.0174 (USD); Composition: Thick Film; Features: -; Tolerance: ±1%; Package / Case: 0402 (1005 Metric); Size / Dimension: 0.039" L x 0.020" W (1.00mm x 0.50mm); Height: 0.016" (0.40mm); Number of Terminations: 2; Packaging: Cut Tape (CT); ComponentLink1URL: http://www.vishay.com/doc?20035; ComponentLink1Description: http://www.vishay.com/doc?20035; .Checked SCH: used
R22 R153 = RC0402JR-070RL: as R5 on sheet [04] - VIDEO INPUT; Category: Resistors; Manufacturer Part Number: RC0402JR-070RL; Package / Case: 0402 (1005 Metric); Price 1k [$]: 0.01389; Value: 0R; .Checked SCH: used; Supplier Part Number: 311-0.0JRCT-ND; Supplier: Digikey; Supplier 1: Digi-Key; Supplier Part Number 1: 311-0.0JRCT-ND; RoHS: RoHS Compliant; Stock 1: 1106330; Pricing 1: 10=0.012, 50=0.009, 100=0.0069, 250=0.00512, 500=0.0038, 1000=0.00253 (USD); Composition: Thick Film; Features: -; Temperature Coefficient: -; Size / Dimension: 0.039" L x 0.020" W (1.00mm x 0.50mm); Height: 0.016" (0.40mm); Number of Terminations: 2; Packaging: Cut Tape (CT); ComponentLink1URL: http://www.yageo.com/documents/recent/PYu-RC0402_51_RoHS_L_6.pdf; ComponentLink1Description: http://www.yageo.com/documents/recent/PYu-RC0402_51_RoHS_L_6.pdf
TP1 = TP_25MILC: Test Point 25mil
U6 = TPS74801DRCR: as U2 on sheet [04] - VIDEO INPUT; Supplier 1: Digi-Key; Manufacturer Part Number: TPS74801DRCR; RoHS: RoHS Compliant; Category: Integrated Circuits (ICs); Stock 1: 11680; Pricing 1: 1=2.3, 10=2.074, 25=1.8576, 100=0.972, 250=0.954, 500=0.936, 750=0.918 (USD); Packaging: Cut Tape (CT); Operating Temperature: -40°C ~ 125°C; Mounting Type: Surface Mount; Package / Case: 10-VFDFN Exposed Pad; Supplier Device Package: 10-SON (3x3); ComponentLink1URL: http://www.ti.com/lit/ds/symlink/tps74801.pdf; ComponentLink1Description: http://www.ti.com/lit/ds/symlink/tps74801.pdf; Supplier Part Number 1: 296-21563-1-ND; .Checked SCH: used